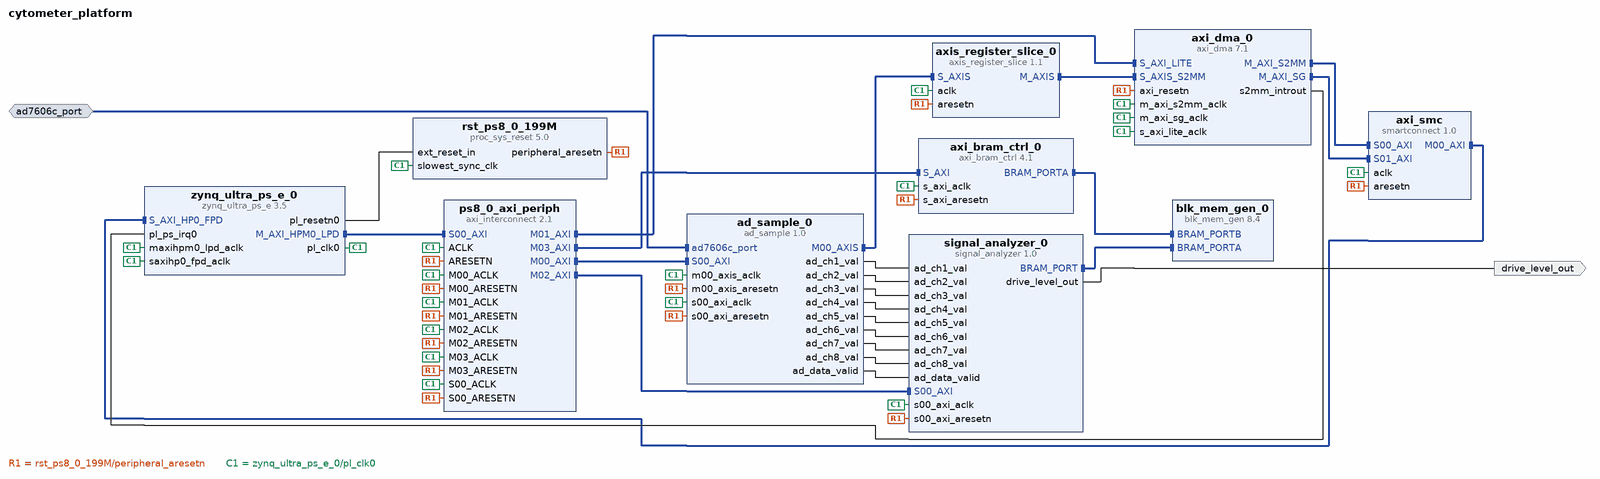
[diagram p0: block diagram of the top level]
# Vivado block design cytometer_platform, xczu2cg-sfvc784-1-e, Vivado 2023.1
create_bd_design cytometer_platform

create_bd_intf_port -mode Slave -vlnv kissfire.icu:user:ad7606c_port_rtl:1.0 ad7606c_port
create_bd_port -dir O drive_level_out

create_bd_cell -type ip -vlnv xilinx.com:ip:zynq_ultra_ps_e:3.5 zynq_ultra_ps_e_0
set_property -dict [list \
  CONFIG.CAN0_BOARD_INTERFACE custom \
  CONFIG.CAN1_BOARD_INTERFACE custom \
  CONFIG.CSU_BOARD_INTERFACE custom \
  CONFIG.DP_BOARD_INTERFACE custom \
  CONFIG.GEM0_BOARD_INTERFACE custom \
  CONFIG.GEM1_BOARD_INTERFACE custom \
  CONFIG.GEM2_BOARD_INTERFACE custom \
  CONFIG.GEM3_BOARD_INTERFACE custom \
  CONFIG.GPIO_BOARD_INTERFACE custom \
  CONFIG.IIC0_BOARD_INTERFACE custom \
  CONFIG.IIC1_BOARD_INTERFACE custom \
  CONFIG.NAND_BOARD_INTERFACE custom \
  CONFIG.PCIE_BOARD_INTERFACE custom \
  CONFIG.PJTAG_BOARD_INTERFACE custom \
  CONFIG.PMU_BOARD_INTERFACE custom \
  CONFIG.PSU_BANK_0_IO_STANDARD LVCMOS18 \
  CONFIG.PSU_BANK_1_IO_STANDARD LVCMOS18 \
  CONFIG.PSU_BANK_2_IO_STANDARD LVCMOS18 \
  CONFIG.PSU_BANK_3_IO_STANDARD LVCMOS33 \
  CONFIG.PSU_USB3__DUAL_CLOCK_ENABLE 1 \
  CONFIG.PSU__ACPU2__POWER__ON 0 \
  CONFIG.PSU__ACPU3__POWER__ON 0 \
  CONFIG.PSU__CAN1__PERIPHERAL__ENABLE 0 \
  CONFIG.PSU__CRF_APB__ACPU_CTRL__FREQMHZ 1200 \
  CONFIG.PSU__CRF_APB__ACPU_CTRL__SRCSEL APLL \
  CONFIG.PSU__CRF_APB__APLL_CTRL__SRCSEL PSS_REF_CLK \
  CONFIG.PSU__CRF_APB__DBG_FPD_CTRL__FREQMHZ 250 \
  CONFIG.PSU__CRF_APB__DBG_FPD_CTRL__SRCSEL IOPLL \
  CONFIG.PSU__CRF_APB__DBG_TRACE_CTRL__FREQMHZ 250 \
  CONFIG.PSU__CRF_APB__DBG_TRACE_CTRL__SRCSEL IOPLL \
  CONFIG.PSU__CRF_APB__DBG_TSTMP_CTRL__FREQMHZ 250 \
  CONFIG.PSU__CRF_APB__DBG_TSTMP_CTRL__SRCSEL IOPLL \
  CONFIG.PSU__CRF_APB__DDR_CTRL__FREQMHZ 1200 \
  CONFIG.PSU__CRF_APB__DDR_CTRL__SRCSEL DPLL \
  CONFIG.PSU__CRF_APB__DPDMA_REF_CTRL__FREQMHZ 600 \
  CONFIG.PSU__CRF_APB__DPDMA_REF_CTRL__SRCSEL DPLL \
  CONFIG.PSU__CRF_APB__DPLL_CTRL__SRCSEL PSS_REF_CLK \
  CONFIG.PSU__CRF_APB__DP_AUDIO_REF_CTRL__SRCSEL RPLL \
  CONFIG.PSU__CRF_APB__DP_STC_REF_CTRL__SRCSEL RPLL \
  CONFIG.PSU__CRF_APB__DP_VIDEO_REF_CTRL__SRCSEL VPLL \
  CONFIG.PSU__CRF_APB__GDMA_REF_CTRL__FREQMHZ 600 \
  CONFIG.PSU__CRF_APB__GDMA_REF_CTRL__SRCSEL DPLL \
  CONFIG.PSU__CRF_APB__GPU_REF_CTRL__FREQMHZ 600 \
  CONFIG.PSU__CRF_APB__GPU_REF_CTRL__SRCSEL DPLL \
  CONFIG.PSU__CRF_APB__TOPSW_LSBUS_CTRL__FREQMHZ 100 \
  CONFIG.PSU__CRF_APB__TOPSW_LSBUS_CTRL__SRCSEL IOPLL \
  CONFIG.PSU__CRF_APB__TOPSW_MAIN_CTRL__FREQMHZ 533.333 \
  CONFIG.PSU__CRF_APB__TOPSW_MAIN_CTRL__SRCSEL APLL \
  CONFIG.PSU__CRF_APB__VPLL_CTRL__SRCSEL PSS_REF_CLK \
  CONFIG.PSU__CRL_APB__ADMA_REF_CTRL__FREQMHZ 500 \
  CONFIG.PSU__CRL_APB__ADMA_REF_CTRL__SRCSEL IOPLL \
  CONFIG.PSU__CRL_APB__CAN1_REF_CTRL__FREQMHZ 100 \
  CONFIG.PSU__CRL_APB__CAN1_REF_CTRL__SRCSEL IOPLL \
  CONFIG.PSU__CRL_APB__CPU_R5_CTRL__FREQMHZ 500 \
  CONFIG.PSU__CRL_APB__CPU_R5_CTRL__SRCSEL IOPLL \
  CONFIG.PSU__CRL_APB__DBG_LPD_CTRL__FREQMHZ 250 \
  CONFIG.PSU__CRL_APB__DBG_LPD_CTRL__SRCSEL IOPLL \
  CONFIG.PSU__CRL_APB__GEM3_REF_CTRL__FREQMHZ 125 \
  CONFIG.PSU__CRL_APB__GEM3_REF_CTRL__SRCSEL IOPLL \
  CONFIG.PSU__CRL_APB__I2C0_REF_CTRL__FREQMHZ 100 \
  CONFIG.PSU__CRL_APB__I2C0_REF_CTRL__SRCSEL IOPLL \
  CONFIG.PSU__CRL_APB__I2C1_REF_CTRL__FREQMHZ 100 \
  CONFIG.PSU__CRL_APB__I2C1_REF_CTRL__SRCSEL IOPLL \
  CONFIG.PSU__CRL_APB__IOPLL_CTRL__SRCSEL PSS_REF_CLK \
  CONFIG.PSU__CRL_APB__IOU_SWITCH_CTRL__FREQMHZ 267 \
  CONFIG.PSU__CRL_APB__IOU_SWITCH_CTRL__SRCSEL RPLL \
  CONFIG.PSU__CRL_APB__LPD_LSBUS_CTRL__FREQMHZ 100 \
  CONFIG.PSU__CRL_APB__LPD_LSBUS_CTRL__SRCSEL IOPLL \
  CONFIG.PSU__CRL_APB__LPD_SWITCH_CTRL__FREQMHZ 500 \
  CONFIG.PSU__CRL_APB__LPD_SWITCH_CTRL__SRCSEL IOPLL \
  CONFIG.PSU__CRL_APB__PCAP_CTRL__FREQMHZ 200 \
  CONFIG.PSU__CRL_APB__PCAP_CTRL__SRCSEL IOPLL \
  CONFIG.PSU__CRL_APB__PL0_REF_CTRL__FREQMHZ 200 \
  CONFIG.PSU__CRL_APB__PL0_REF_CTRL__SRCSEL RPLL \
  CONFIG.PSU__CRL_APB__QSPI_REF_CTRL__FREQMHZ 300 \
  CONFIG.PSU__CRL_APB__QSPI_REF_CTRL__SRCSEL IOPLL \
  CONFIG.PSU__CRL_APB__RPLL_CTRL__SRCSEL PSS_REF_CLK \
  CONFIG.PSU__CRL_APB__SDIO0_REF_CTRL__SRCSEL IOPLL \
  CONFIG.PSU__CRL_APB__SDIO1_REF_CTRL__FREQMHZ 200 \
  CONFIG.PSU__CRL_APB__SDIO1_REF_CTRL__SRCSEL IOPLL \
  CONFIG.PSU__CRL_APB__TIMESTAMP_REF_CTRL__FREQMHZ 100 \
  CONFIG.PSU__CRL_APB__TIMESTAMP_REF_CTRL__SRCSEL PSS_REF_CLK \
  CONFIG.PSU__CRL_APB__UART0_REF_CTRL__FREQMHZ 100 \
  CONFIG.PSU__CRL_APB__UART0_REF_CTRL__SRCSEL IOPLL \
  CONFIG.PSU__CRL_APB__UART1_REF_CTRL__FREQMHZ 100 \
  CONFIG.PSU__CRL_APB__UART1_REF_CTRL__SRCSEL IOPLL \
  CONFIG.PSU__CRL_APB__USB0_BUS_REF_CTRL__FREQMHZ 250 \
  CONFIG.PSU__CRL_APB__USB0_BUS_REF_CTRL__SRCSEL IOPLL \
  CONFIG.PSU__CRL_APB__USB3_DUAL_REF_CTRL__FREQMHZ 20 \
  CONFIG.PSU__CRL_APB__USB3_DUAL_REF_CTRL__SRCSEL IOPLL \
  CONFIG.PSU__CRL_APB__USB3__ENABLE 1 \
  CONFIG.PSU__CSUPMU__PERIPHERAL__VALID 0 \
  CONFIG.PSU__DDRC__BUS_WIDTH {64 Bit} \
  CONFIG.PSU__DDRC__COMPONENTS Components \
  CONFIG.PSU__DDRC__DEVICE_CAPACITY {4096 MBits} \
  CONFIG.PSU__DDRC__DRAM_WIDTH {16 Bits} \
  CONFIG.PSU__DDRC__ECC Disabled \
  CONFIG.PSU__DDRC__MEMORY_TYPE {DDR 4} \
  CONFIG.PSU__DDRC__SPEED_BIN DDR4_2400P \
  CONFIG.PSU__DDR_HIGH_ADDRESS_GUI_ENABLE 0 \
  CONFIG.PSU__DDR__INTERFACE__FREQMHZ 600.000 \
  CONFIG.PSU__DEVICE_TYPE CG \
  CONFIG.PSU__DISPLAYPORT__LANE0__ENABLE 1 \
  CONFIG.PSU__DISPLAYPORT__LANE0__IO {GT Lane3} \
  CONFIG.PSU__DISPLAYPORT__LANE1__ENABLE 1 \
  CONFIG.PSU__DISPLAYPORT__LANE1__IO {GT Lane2} \
  CONFIG.PSU__DISPLAYPORT__PERIPHERAL__ENABLE 1 \
  CONFIG.PSU__DLL__ISUSED 1 \
  CONFIG.PSU__DPAUX__PERIPHERAL__ENABLE 1 \
  CONFIG.PSU__DPAUX__PERIPHERAL__IO {MIO 27 .. 30} \
  CONFIG.PSU__DP__LANE_SEL {Dual Higher} \
  CONFIG.PSU__DP__REF_CLK_FREQ 27 \
  CONFIG.PSU__DP__REF_CLK_SEL {Ref Clk2} \
  CONFIG.PSU__ENET3__FIFO__ENABLE 0 \
  CONFIG.PSU__ENET3__GRP_MDIO__ENABLE 1 \
  CONFIG.PSU__ENET3__GRP_MDIO__IO {MIO 76 .. 77} \
  CONFIG.PSU__ENET3__PERIPHERAL__ENABLE 1 \
  CONFIG.PSU__ENET3__PERIPHERAL__IO {MIO 64 .. 75} \
  CONFIG.PSU__ENET3__PTP__ENABLE 0 \
  CONFIG.PSU__ENET3__TSU__ENABLE 0 \
  CONFIG.PSU__FPD_SLCR__WDT1__FREQMHZ 100 \
  CONFIG.PSU__FPGA_PL0_ENABLE 1 \
  CONFIG.PSU__GEM3_COHERENCY 0 \
  CONFIG.PSU__GEM3_ROUTE_THROUGH_FPD 0 \
  CONFIG.PSU__GEM__TSU__ENABLE 0 \
  CONFIG.PSU__GPIO0_MIO__PERIPHERAL__ENABLE 0 \
  CONFIG.PSU__GPIO1_MIO__IO {MIO 26 .. 51} \
  CONFIG.PSU__GPIO1_MIO__PERIPHERAL__ENABLE 1 \
  CONFIG.PSU__GPU_PP0__POWER__ON 0 \
  CONFIG.PSU__GPU_PP1__POWER__ON 0 \
  CONFIG.PSU__GT__LINK_SPEED HBR \
  CONFIG.PSU__GT__PRE_EMPH_LVL_4 0 \
  CONFIG.PSU__GT__VLT_SWNG_LVL_4 0 \
  CONFIG.PSU__I2C0__PERIPHERAL__ENABLE 0 \
  CONFIG.PSU__I2C1__PERIPHERAL__ENABLE 1 \
  CONFIG.PSU__I2C1__PERIPHERAL__IO {MIO 32 .. 33} \
  CONFIG.PSU__IOU_SLCR__IOU_TTC_APB_CLK__TTC0_SEL APB \
  CONFIG.PSU__IOU_SLCR__IOU_TTC_APB_CLK__TTC1_SEL APB \
  CONFIG.PSU__IOU_SLCR__IOU_TTC_APB_CLK__TTC2_SEL APB \
  CONFIG.PSU__IOU_SLCR__IOU_TTC_APB_CLK__TTC3_SEL APB \
  CONFIG.PSU__IOU_SLCR__WDT0__FREQMHZ 100 \
  CONFIG.PSU__LPD_SLCR__CSUPMU__FREQMHZ 100 \
  CONFIG.PSU__OVERRIDE_HPX_QOS 0 \
  CONFIG.PSU__OVERRIDE__BASIC_CLOCK 0 \
  CONFIG.PSU__PCIE__BAR0_VAL 0x0 \
  CONFIG.PSU__PCIE__BAR1_VAL 0x0 \
  CONFIG.PSU__PCIE__BAR2_VAL 0x0 \
  CONFIG.PSU__PCIE__BAR3_VAL 0x0 \
  CONFIG.PSU__PCIE__BAR4_VAL 0x0 \
  CONFIG.PSU__PCIE__BAR5_VAL 0x0 \
  CONFIG.PSU__PCIE__CLASS_CODE_BASE 0x06 \
  CONFIG.PSU__PCIE__CLASS_CODE_INTERFACE 0x0 \
  CONFIG.PSU__PCIE__CLASS_CODE_SUB 0x04 \
  CONFIG.PSU__PCIE__CLASS_CODE_VALUE 0x60400 \
  CONFIG.PSU__PCIE__DEVICE_ID 0xD011 \
  CONFIG.PSU__PCIE__DEVICE_PORT_TYPE {Root Port} \
  CONFIG.PSU__PCIE__EROM_VAL 0x0 \
  CONFIG.PSU__PCIE__LANE0__ENABLE 1 \
  CONFIG.PSU__PCIE__LANE0__IO {GT Lane0} \
  CONFIG.PSU__PCIE__LINK_SPEED {5.0 Gb/s} \
  CONFIG.PSU__PCIE__MAXIMUM_LINK_WIDTH x1 \
  CONFIG.PSU__PCIE__MAX_PAYLOAD_SIZE {256 bytes} \
  CONFIG.PSU__PCIE__PERIPHERAL__ENABLE 1 \
  CONFIG.PSU__PCIE__PERIPHERAL__ENDPOINT_ENABLE 0 \
  CONFIG.PSU__PCIE__PERIPHERAL__ROOTPORT_ENABLE 1 \
  CONFIG.PSU__PCIE__PERIPHERAL__ROOTPORT_IO {MIO 37} \
  CONFIG.PSU__PCIE__REF_CLK_FREQ 100 \
  CONFIG.PSU__PCIE__REF_CLK_SEL {Ref Clk0} \
  CONFIG.PSU__PCIE__REVISION_ID 0x0 \
  CONFIG.PSU__PCIE__SUBSYSTEM_ID 0x7 \
  CONFIG.PSU__PCIE__SUBSYSTEM_VENDOR_ID 0x10EE \
  CONFIG.PSU__PCIE__VENDOR_ID 0x10EE \
  CONFIG.PSU__PMU__PERIPHERAL__ENABLE 0 \
  CONFIG.PSU__PRESET_APPLIED 0 \
  CONFIG.PSU__PSS_REF_CLK__FREQMHZ 33.333 \
  CONFIG.PSU__QSPI_COHERENCY 0 \
  CONFIG.PSU__QSPI_ROUTE_THROUGH_FPD 0 \
  CONFIG.PSU__QSPI__GRP_FBCLK__ENABLE 1 \
  CONFIG.PSU__QSPI__GRP_FBCLK__IO {MIO 6} \
  CONFIG.PSU__QSPI__PERIPHERAL__DATA_MODE x4 \
  CONFIG.PSU__QSPI__PERIPHERAL__ENABLE 1 \
  CONFIG.PSU__QSPI__PERIPHERAL__IO {MIO 0 .. 5} \
  CONFIG.PSU__QSPI__PERIPHERAL__MODE Single \
  CONFIG.PSU__SATA__PERIPHERAL__ENABLE 0 \
  CONFIG.PSU__SD0__CLK_200_SDR_OTAP_DLY 0x3 \
  CONFIG.PSU__SD0__CLK_50_DDR_ITAP_DLY 0x12 \
  CONFIG.PSU__SD0__CLK_50_DDR_OTAP_DLY 0x6 \
  CONFIG.PSU__SD0__CLK_50_SDR_ITAP_DLY 0x15 \
  CONFIG.PSU__SD0__CLK_50_SDR_OTAP_DLY 0x6 \
  CONFIG.PSU__SD0__DATA_TRANSFER_MODE 8Bit \
  CONFIG.PSU__SD0__GRP_POW__ENABLE 1 \
  CONFIG.PSU__SD0__GRP_POW__IO {MIO 23} \
  CONFIG.PSU__SD0__PERIPHERAL__ENABLE 1 \
  CONFIG.PSU__SD0__PERIPHERAL__IO {MIO 13 .. 22} \
  CONFIG.PSU__SD0__RESET__ENABLE 1 \
  CONFIG.PSU__SD0__SLOT_TYPE eMMC \
  CONFIG.PSU__SD1_COHERENCY 0 \
  CONFIG.PSU__SD1_ROUTE_THROUGH_FPD 0 \
  CONFIG.PSU__SD1__CLK_50_SDR_ITAP_DLY 0x15 \
  CONFIG.PSU__SD1__CLK_50_SDR_OTAP_DLY 0x5 \
  CONFIG.PSU__SD1__DATA_TRANSFER_MODE 4Bit \
  CONFIG.PSU__SD1__GRP_CD__ENABLE 1 \
  CONFIG.PSU__SD1__GRP_CD__IO {MIO 45} \
  CONFIG.PSU__SD1__GRP_POW__ENABLE 0 \
  CONFIG.PSU__SD1__GRP_WP__ENABLE 0 \
  CONFIG.PSU__SD1__PERIPHERAL__ENABLE 1 \
  CONFIG.PSU__SD1__PERIPHERAL__IO {MIO 46 .. 51} \
  CONFIG.PSU__SD1__SLOT_TYPE {SD 2.0} \
  CONFIG.PSU__SWDT0__PERIPHERAL__ENABLE 0 \
  CONFIG.PSU__SWDT1__PERIPHERAL__ENABLE 0 \
  CONFIG.PSU__TSU__BUFG_PORT_PAIR 0 \
  CONFIG.PSU__TTC0__CLOCK__ENABLE 0 \
  CONFIG.PSU__TTC0__PERIPHERAL__ENABLE 1 \
  CONFIG.PSU__TTC0__WAVEOUT__ENABLE 0 \
  CONFIG.PSU__TTC1__CLOCK__ENABLE 0 \
  CONFIG.PSU__TTC1__PERIPHERAL__ENABLE 1 \
  CONFIG.PSU__TTC1__WAVEOUT__ENABLE 0 \
  CONFIG.PSU__TTC2__CLOCK__ENABLE 0 \
  CONFIG.PSU__TTC2__PERIPHERAL__ENABLE 1 \
  CONFIG.PSU__TTC2__WAVEOUT__ENABLE 0 \
  CONFIG.PSU__TTC3__CLOCK__ENABLE 0 \
  CONFIG.PSU__TTC3__PERIPHERAL__ENABLE 1 \
  CONFIG.PSU__TTC3__WAVEOUT__ENABLE 0 \
  CONFIG.PSU__UART0__PERIPHERAL__ENABLE 0 \
  CONFIG.PSU__UART1__BAUD_RATE 115200 \
  CONFIG.PSU__UART1__MODEM__ENABLE 0 \
  CONFIG.PSU__UART1__PERIPHERAL__ENABLE 1 \
  CONFIG.PSU__UART1__PERIPHERAL__IO {MIO 24 .. 25} \
  CONFIG.PSU__USB0_COHERENCY 0 \
  CONFIG.PSU__USB0__PERIPHERAL__ENABLE 1 \
  CONFIG.PSU__USB0__PERIPHERAL__IO {MIO 52 .. 63} \
  CONFIG.PSU__USB0__REF_CLK_FREQ 26 \
  CONFIG.PSU__USB0__REF_CLK_SEL {Ref Clk1} \
  CONFIG.PSU__USB0__RESET__ENABLE 1 \
  CONFIG.PSU__USB0__RESET__IO {MIO 44} \
  CONFIG.PSU__USB2_0__EMIO__ENABLE 0 \
  CONFIG.PSU__USB3_0__EMIO__ENABLE 0 \
  CONFIG.PSU__USB3_0__PERIPHERAL__ENABLE 1 \
  CONFIG.PSU__USB3_0__PERIPHERAL__IO {GT Lane1} \
  CONFIG.PSU__USB__RESET__MODE {Shared MIO Pin} \
  CONFIG.PSU__USB__RESET__POLARITY {Active Low} \
  CONFIG.PSU__USE__IRQ0 1 \
  CONFIG.PSU__USE__M_AXI_GP0 0 \
  CONFIG.PSU__USE__M_AXI_GP1 0 \
  CONFIG.PSU__USE__M_AXI_GP2 1 \
  CONFIG.PSU__USE__S_AXI_GP2 1 \
  CONFIG.QSPI_BOARD_INTERFACE custom \
  CONFIG.SATA_BOARD_INTERFACE custom \
  CONFIG.SD0_BOARD_INTERFACE custom \
  CONFIG.SD1_BOARD_INTERFACE custom \
  CONFIG.SPI0_BOARD_INTERFACE custom \
  CONFIG.SPI1_BOARD_INTERFACE custom \
  CONFIG.SUBPRESET1 DDR4_MICRON_MT40A256M16GE_083E \
  CONFIG.SUBPRESET2 Custom \
  CONFIG.SWDT0_BOARD_INTERFACE custom \
  CONFIG.SWDT1_BOARD_INTERFACE custom \
  CONFIG.TRACE_BOARD_INTERFACE custom \
  CONFIG.TTC0_BOARD_INTERFACE custom \
  CONFIG.TTC1_BOARD_INTERFACE custom \
  CONFIG.TTC2_BOARD_INTERFACE custom \
  CONFIG.TTC3_BOARD_INTERFACE custom \
  CONFIG.UART0_BOARD_INTERFACE custom \
  CONFIG.UART1_BOARD_INTERFACE custom \
  CONFIG.USB0_BOARD_INTERFACE custom \
  CONFIG.USB1_BOARD_INTERFACE custom \
  CONFIG.preset None \
] [get_bd_cells zynq_ultra_ps_e_0]
# 736 more settings of zynq_ultra_ps_e_0 are not shown: defaults, MIO pin electricals, DDR timing, and values the tool derives
create_bd_cell -type ip -vlnv xilinx.com:ip:axi_interconnect:2.1 ps8_0_axi_periph
set_property -dict {CONFIG.NUM_MI 4} [get_bd_cells ps8_0_axi_periph]
create_bd_cell -type ip -vlnv xilinx.com:ip:proc_sys_reset:5.0 rst_ps8_0_199M
create_bd_cell -type ip -vlnv xilinx.com:ip:axi_dma:7.1 axi_dma_0
set_property -dict [list \
  CONFIG.c_addr_width 64 \
  CONFIG.c_include_mm2s 0 \
  CONFIG.c_m_axi_s2mm_data_width 64 \
  CONFIG.c_s2mm_burst_size 256 \
  CONFIG.c_s_axis_s2mm_tdata_width 32 \
  CONFIG.c_sg_include_stscntrl_strm 0 \
  CONFIG.c_sg_length_width 26 \
] [get_bd_cells axi_dma_0]
create_bd_cell -type ip -vlnv xilinx.com:ip:smartconnect:1.0 axi_smc
set_property -dict {CONFIG.NUM_SI 2} [get_bd_cells axi_smc]
create_bd_cell -type ip -vlnv xilinx.com:ip:axis_register_slice:1.1 axis_register_slice_0
set_property -dict {CONFIG.HAS_TKEEP 1 CONFIG.HAS_TLAST 1 CONFIG.TDATA_NUM_BYTES 4} [get_bd_cells axis_register_slice_0]
create_bd_cell -type ip -vlnv xilinx.com:ip:blk_mem_gen:8.4 blk_mem_gen_0
set_property -dict [list \
  CONFIG.Assume_Synchronous_Clk true \
  CONFIG.EN_SAFETY_CKT false \
  CONFIG.Memory_Type True_Dual_Port_RAM \
] [get_bd_cells blk_mem_gen_0]
create_bd_cell -type ip -vlnv xilinx.com:ip:axi_bram_ctrl:4.1 axi_bram_ctrl_0
set_property -dict {CONFIG.SINGLE_PORT_BRAM 1} [get_bd_cells axi_bram_ctrl_0]
create_bd_cell -type ip -vlnv xilinx.com:user:ad_sample:1.0 ad_sample_0
create_bd_cell -type ip -vlnv xilinx.com:user:signal_analyzer:1.0 signal_analyzer_0

# ---- connections ----

connect_bd_intf_net -intf_net ad7606c_port_0_1 [get_bd_intf_ports ad7606c_port] [get_bd_intf_pins ad_sample_0/ad7606c_port]
connect_bd_intf_net [get_bd_intf_pins ad_sample_0/M00_AXIS] [get_bd_intf_pins axis_register_slice_0/S_AXIS]
connect_bd_intf_net [get_bd_intf_pins axi_bram_ctrl_0/BRAM_PORTA] [get_bd_intf_pins blk_mem_gen_0/BRAM_PORTB]
connect_bd_intf_net [get_bd_intf_pins axi_dma_0/M_AXI_S2MM] [get_bd_intf_pins axi_smc/S00_AXI]
connect_bd_intf_net [get_bd_intf_pins axi_dma_0/M_AXI_SG] [get_bd_intf_pins axi_smc/S01_AXI]
connect_bd_intf_net [get_bd_intf_pins axi_smc/M00_AXI] [get_bd_intf_pins zynq_ultra_ps_e_0/S_AXI_HP0_FPD]
connect_bd_intf_net [get_bd_intf_pins axis_register_slice_0/M_AXIS] [get_bd_intf_pins axi_dma_0/S_AXIS_S2MM]
connect_bd_intf_net [get_bd_intf_pins ps8_0_axi_periph/M00_AXI] [get_bd_intf_pins ad_sample_0/S00_AXI]
connect_bd_intf_net [get_bd_intf_pins ps8_0_axi_periph/M01_AXI] [get_bd_intf_pins axi_dma_0/S_AXI_LITE]
connect_bd_intf_net [get_bd_intf_pins ps8_0_axi_periph/M02_AXI] [get_bd_intf_pins signal_analyzer_0/S00_AXI]
connect_bd_intf_net [get_bd_intf_pins ps8_0_axi_periph/M03_AXI] [get_bd_intf_pins axi_bram_ctrl_0/S_AXI]
connect_bd_intf_net [get_bd_intf_pins signal_analyzer_0/BRAM_PORT] [get_bd_intf_pins blk_mem_gen_0/BRAM_PORTA]
connect_bd_intf_net [get_bd_intf_pins zynq_ultra_ps_e_0/M_AXI_HPM0_LPD] [get_bd_intf_pins ps8_0_axi_periph/S00_AXI]
connect_bd_net [get_bd_pins ad_sample_0/ad_ch1_val] [get_bd_pins signal_analyzer_0/ad_ch1_val]
connect_bd_net [get_bd_pins ad_sample_0/ad_ch2_val] [get_bd_pins signal_analyzer_0/ad_ch2_val]
connect_bd_net [get_bd_pins ad_sample_0/ad_ch3_val] [get_bd_pins signal_analyzer_0/ad_ch3_val]
connect_bd_net [get_bd_pins ad_sample_0/ad_ch4_val] [get_bd_pins signal_analyzer_0/ad_ch4_val]
connect_bd_net [get_bd_pins ad_sample_0/ad_ch5_val] [get_bd_pins signal_analyzer_0/ad_ch5_val]
connect_bd_net [get_bd_pins ad_sample_0/ad_ch6_val] [get_bd_pins signal_analyzer_0/ad_ch6_val]
connect_bd_net [get_bd_pins ad_sample_0/ad_ch7_val] [get_bd_pins signal_analyzer_0/ad_ch7_val]
connect_bd_net [get_bd_pins ad_sample_0/ad_ch8_val] [get_bd_pins signal_analyzer_0/ad_ch8_val]
connect_bd_net [get_bd_pins ad_sample_0/ad_data_valid] [get_bd_pins signal_analyzer_0/ad_data_valid]
connect_bd_net [get_bd_pins axi_dma_0/s2mm_introut] [get_bd_pins zynq_ultra_ps_e_0/pl_ps_irq0]
connect_bd_net [get_bd_pins rst_ps8_0_199M/peripheral_aresetn] \
  [get_bd_pins ps8_0_axi_periph/S00_ARESETN] [get_bd_pins ps8_0_axi_periph/M00_ARESETN] \
  [get_bd_pins ps8_0_axi_periph/ARESETN] [get_bd_pins axi_dma_0/axi_resetn] [get_bd_pins ps8_0_axi_periph/M01_ARESETN] \
  [get_bd_pins axi_smc/aresetn] [get_bd_pins axis_register_slice_0/aresetn] [get_bd_pins ps8_0_axi_periph/M02_ARESETN] \
  [get_bd_pins ps8_0_axi_periph/M03_ARESETN] [get_bd_pins axi_bram_ctrl_0/s_axi_aresetn] \
  [get_bd_pins ad_sample_0/s00_axi_aresetn] [get_bd_pins ad_sample_0/m00_axis_aresetn] \
  [get_bd_pins signal_analyzer_0/s00_axi_aresetn]
connect_bd_net [get_bd_pins signal_analyzer_0/drive_level_out] [get_bd_ports drive_level_out]
connect_bd_net [get_bd_pins zynq_ultra_ps_e_0/pl_clk0] \
  [get_bd_pins zynq_ultra_ps_e_0/maxihpm0_lpd_aclk] [get_bd_pins ps8_0_axi_periph/S00_ACLK] \
  [get_bd_pins rst_ps8_0_199M/slowest_sync_clk] [get_bd_pins ps8_0_axi_periph/M00_ACLK] [get_bd_pins ps8_0_axi_periph/ACLK] \
  [get_bd_pins axi_dma_0/s_axi_lite_aclk] [get_bd_pins ps8_0_axi_periph/M01_ACLK] [get_bd_pins axi_dma_0/m_axi_s2mm_aclk] \
  [get_bd_pins axi_smc/aclk] [get_bd_pins zynq_ultra_ps_e_0/saxihp0_fpd_aclk] [get_bd_pins axi_dma_0/m_axi_sg_aclk] \
  [get_bd_pins axis_register_slice_0/aclk] [get_bd_pins ps8_0_axi_periph/M02_ACLK] [get_bd_pins ps8_0_axi_periph/M03_ACLK] \
  [get_bd_pins axi_bram_ctrl_0/s_axi_aclk] [get_bd_pins ad_sample_0/s00_axi_aclk] [get_bd_pins ad_sample_0/m00_axis_aclk] \
  [get_bd_pins signal_analyzer_0/s00_axi_aclk]
connect_bd_net [get_bd_pins zynq_ultra_ps_e_0/pl_resetn0] [get_bd_pins rst_ps8_0_199M/ext_reset_in]

# ---- address map ----
assign_bd_address -offset 0x0000000000000000 -range 2G -target_address_space [get_bd_addr_spaces axi_dma_0/Data_S2MM] [get_bd_addr_segs zynq_ultra_ps_e_0/SAXIGP2/HP0_DDR_LOW]
assign_bd_address -offset 0x00000000C0000000 -range 512M -target_address_space [get_bd_addr_spaces axi_dma_0/Data_S2MM] [get_bd_addr_segs zynq_ultra_ps_e_0/SAXIGP2/HP0_QSPI]
assign_bd_address -offset 0x00000000E0000000 -range 256M -target_address_space [get_bd_addr_spaces axi_dma_0/Data_S2MM] [get_bd_addr_segs zynq_ultra_ps_e_0/SAXIGP2/HP0_PCIE_LOW]
exclude_bd_addr_seg -offset 0x00000000FF000000 -range 16M -target_address_space [get_bd_addr_spaces axi_dma_0/Data_S2MM] [get_bd_addr_segs zynq_ultra_ps_e_0/SAXIGP2/HP0_LPS_OCM]
assign_bd_address -offset 0x0000000000000000 -range 2G -target_address_space [get_bd_addr_spaces axi_dma_0/Data_SG] [get_bd_addr_segs zynq_ultra_ps_e_0/SAXIGP2/HP0_DDR_LOW]
assign_bd_address -offset 0x00000000C0000000 -range 512M -target_address_space [get_bd_addr_spaces axi_dma_0/Data_SG] [get_bd_addr_segs zynq_ultra_ps_e_0/SAXIGP2/HP0_QSPI]
assign_bd_address -offset 0x00000000E0000000 -range 256M -target_address_space [get_bd_addr_spaces axi_dma_0/Data_SG] [get_bd_addr_segs zynq_ultra_ps_e_0/SAXIGP2/HP0_PCIE_LOW]
exclude_bd_addr_seg -offset 0x00000000FF000000 -range 16M -target_address_space [get_bd_addr_spaces axi_dma_0/Data_SG] [get_bd_addr_segs zynq_ultra_ps_e_0/SAXIGP2/HP0_LPS_OCM]
assign_bd_address -offset 0x0080000000 -range 64K -target_address_space [get_bd_addr_spaces zynq_ultra_ps_e_0/Data] [get_bd_addr_segs ad_sample_0/S00_AXI/S00_AXI_reg]
assign_bd_address -offset 0x0080010000 -range 64K -target_address_space [get_bd_addr_spaces zynq_ultra_ps_e_0/Data] [get_bd_addr_segs axi_dma_0/S_AXI_LITE/Reg]
assign_bd_address -offset 0x0080020000 -range 64K -target_address_space [get_bd_addr_spaces zynq_ultra_ps_e_0/Data] [get_bd_addr_segs signal_analyzer_0/S00_AXI/S00_AXI_reg]
assign_bd_address -offset 0x0082000000 -range 128K -target_address_space [get_bd_addr_spaces zynq_ultra_ps_e_0/Data] [get_bd_addr_segs axi_bram_ctrl_0/S_AXI/Mem0]

validate_bd_design
save_bd_design
